# Altium schematic sheet Display.SchDoc
size A4; SheetNumber: 5; SheetTotal: 5
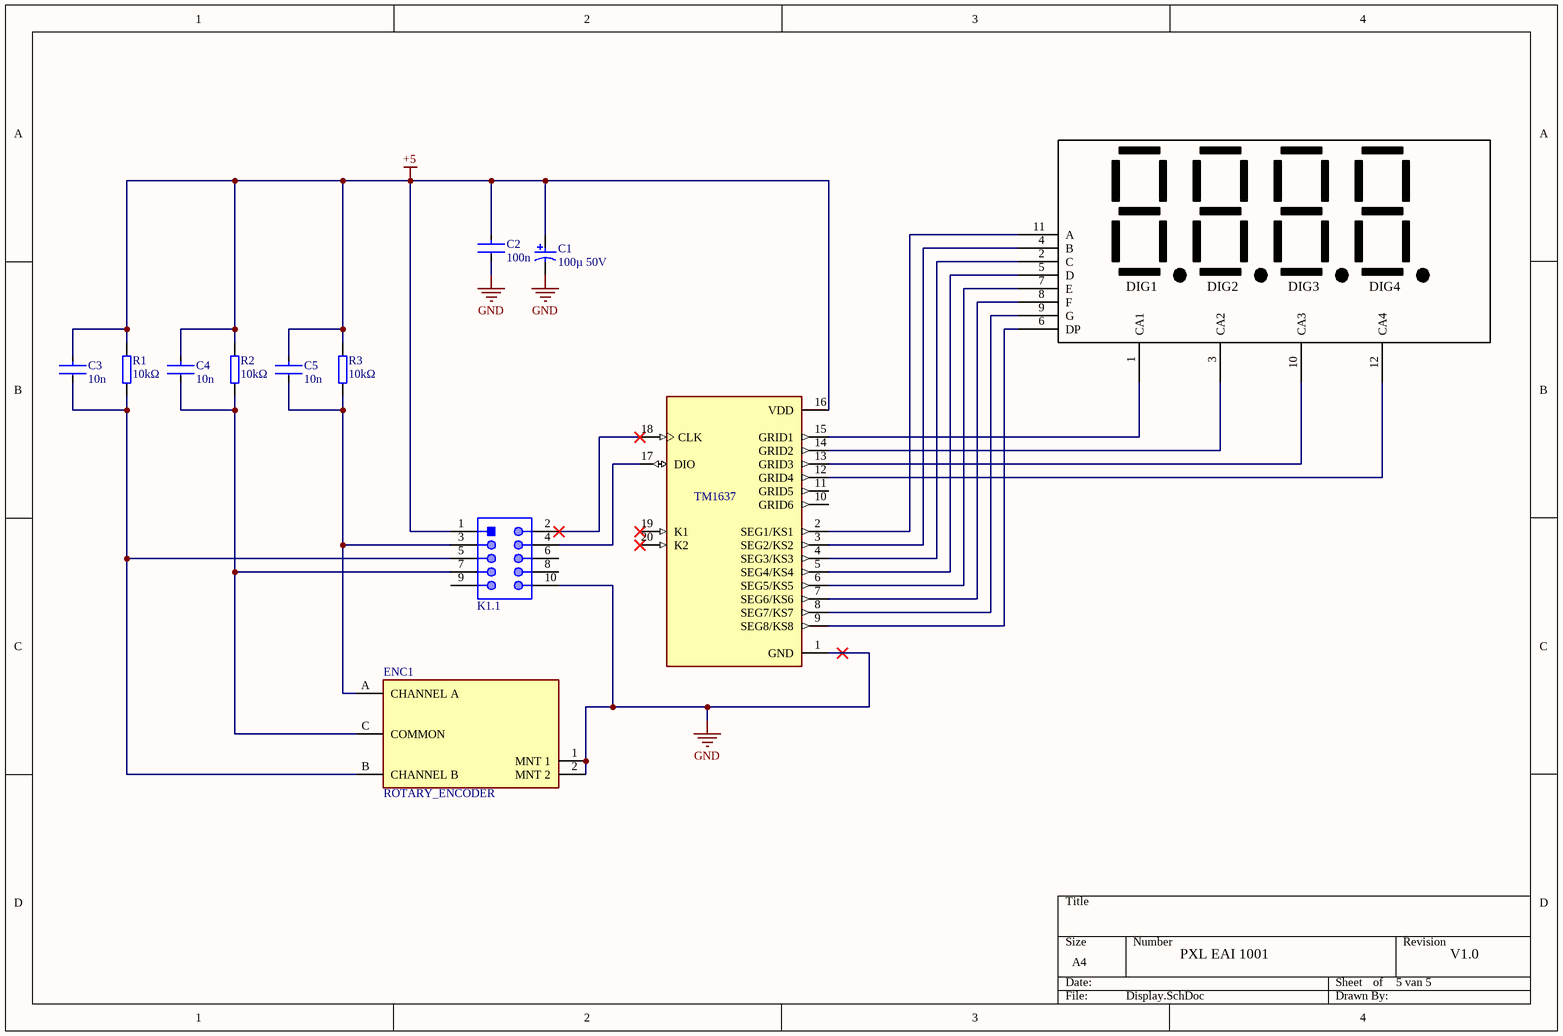
[diagram p0: Display.SchDoc]

## Parts
C1  100µ 50V  [CC_0805_L]
C2  100n  [CC_0805_L]
C3  10n  [CC_0805_L]
C4  10n  [CC_0805_L]
C5  10n  [CC_0805_L]
Display  Sigment  [7-Sigment]  (value not drawn)
ENC1  ROTARY_ENCODER  [PEC11R_4220F_S0012]
K1.1  61201021621  [box header 10-pin]  (value not drawn)
R1  10kΩ  [R_0805_M]
R2  10kΩ  [R_0805_M]
R3  10kΩ  [R_0805_M]
TM1637  TM1637  [SOP_20_M]

## Nets
+5: C1.2 C2.1 C3.1 C4.1 C5.1 K1.1.1 R1.2 R2.2 R3.2 TM1637.16(VDD)
GND: C1.1 C2.2 ENC1.1(MNT_1) ENC1.2(MNT_2) K1.1.10 TM1637.1(GND)
NetC3_2: C3.2 ENC1.B(CHANNEL_B) K1.1.5 R1.1
NetC4_2: C4.2 ENC1.C(COMMON) K1.1.7 R2.1
NetC5_2: C5.2 ENC1.A(CHANNEL_A) K1.1.3 R3.1
NetDisplay_1: Display.1(CA1) TM1637.15(GRID1)
NetDisplay_2: Display.2(C) TM1637.4(SEG3/KS3)
NetDisplay_3: Display.3(CA2) TM1637.14(GRID2)
NetDisplay_4: Display.4(B) TM1637.3(SEG2/KS2)
NetDisplay_5: Display.5(D) TM1637.5(SEG4/KS4)
NetDisplay_6: Display.6(DP) TM1637.9(SEG8/KS8)
NetDisplay_7: Display.7(E) TM1637.6(SEG5/KS5)
NetDisplay_8: Display.8(F) TM1637.7(SEG6/KS6)
NetDisplay_9: Display.9(G) TM1637.8(SEG7/KS7)
NetDisplay_10: Display.10(CA3) TM1637.13(GRID3)
NetDisplay_11: Display.11(A) TM1637.2(SEG1/KS1)
NetDisplay_12: Display.12(CA4) TM1637.12(GRID4)
NetK1.1_2: K1.1.2 TM1637.18(CLK)
NetK1.1_4: K1.1.4 TM1637.17(DIO)

Not connected (* = marked no-connect by the designer): K1.1 6 8 9; TM1637 10(GRID6) 11(GRID5) 19(K1)* 20(K2)*

## Notes on the sheet
- PXL EAI 1001
- V1.0
- (in symbol Display 4digit 7segment) DIG1; DIG2; DIG3; DIG4

## Library data of the parts
C1 = Capacitor_Electrolytic: Manufacturer: Panasonic; Voltage Rating: 25 V; ComponentLink2URL: http://industrial.panasonic.com/cdbs/www-data/pdf/RDE0000/ABA0000C1181.pdf; Height: 10.2 mm; Max Operating Temperature: 105 degC; PackageReference: EEE-FK1E221P; ComponentLink1Description: Manufacturer URL; ComponentLink1URL: http://www.panasonic.com/; Mount: Surface Mount; REACH SVHC: No SVHC; Min Operating Temperature: -55 degC; ComponentLink2Description: Datasheet; DatasheetVersion: 03/2016; Length: 10.2 mm; RoHSCompliant: true; Packaging: Tape and Reel; Package Quantity: 500; Lead Pitch: 3.1 mm; Pins: 2; PackageDescription: 2-Pin Electrolytic Aluminum Capacitor, Body 8.3 x 8.3 mm; Mounting Technology: Surface Mount
C2-C5 = Capacitor_Ceramic: Manufacturer: KEMET; Manufacturer Part Number: C0805C224K5RACTU; Value: 0.22 μF; Temperature Characteristic: X7R; Temperature Coefficient: 30ppm/°C; Tolerance: 0.1; Voltage Rating: 50 V; ComponentLink2URL: https://content.kemet.com/datasheets/KEM_C1003_C0G_SMD.pdf; Device Class L3: Ceramic Capacitors; Lead Free: Yes; Temperature: -55°C to +125°C; RoHS: TRUE; Capacitance: 0.22 μF; Automotive: No; Material: Ceramic; Octopart: https://octopart.com/c0805c224k5ractu-kemet-144670; Temperature Range Low: -55°C; Height: 0.88mm; Device Class L1: Passive Components; Digikey Description: CAP CER 0.22UF 50V X7R 0805; ComponentLink2Description: Datasheet; Mouser Description: CAP CER 0.22UF 50V X7R 0805; Category: Cap; Ipc Land Pattern Name: CAPC200125X78; Temperature Range High: +125°C; Package: C0805C-DN; Device Class L2: Capacitors
Display = Display 4digit 7segment
ENC1 = ROTARY_ENCODER: Manufacturer Part Number: PEC11R-4015F-N0024; Manufacturer: Bourns; Current Rating: 10mA; Number Of Circuits: 1; Conn Orientation: Vertical; Encoder Type: Incremental; Detent: No; Pulses Per Rev: 24; Voltage Rating Dc: 5V; Height: 22.3mm; ComponentLink2URL: https://www.bourns.com/docs/product-datasheets/pec11r.pdf?sfvrsn=bb617cbf_7; Mouser Description: Encoders 15mm SHAFT NO SWITCH; Package: 0; RoHS: TRUE; Temperature Range High: +70°C; Device Class L1: Electromechanical; Device Class L3: Encoders; Temperature Range Low: -30°C; Device Class L2: Switches; Temperature: -30°C to +70°C; Category: Enc; ComponentLink2Description: Datasheet; Lead Free: Yes; Automotive: No; Octopart: https://octopart.com/pec11r-4015f-n0024-bourns-26648251; Digikey Description: ROTARY ENCODER MECHANICAL 24PPR
K1.1 = 5x2: Male Box Header WR-BHD, THT, Vertical, pitch 2.54 mm, 10 pins; Manufacturer: Wurth Elektronik; Contact Resistance: 20mOhm; Withstanding Voltage: 500VAC; Pin Number: 10; Working Voltage: 250VAC; Pitch: 2.54mm; Mounting Technology: THT; Operating Temperature: -40to125degC; Published Date: August2018; Gender: Male; Packaging: Tray; Manufacturer URL: http://www.we-online.de; Datasheet URL: https://katalog.we-online.de/em/datasheet/6120xx21621.pdf; Orientation: Vertical; Package Reference: 61201021621; Part Number: 61201021621; Publisher: WurthElektronik
R1-R3 = Resistor: Manufacturer: Vishay Dale; Part Number: CRCW08050000Z0EA
TM1637 = TM1637: LED Drive Control Special Circuit; MF: Titan Micro Electronics; Package: Package; Availability: Not in stock; SnapEDA_Link: https://www.snapeda.com/parts/TM1637/Titan+Micro+Electronics/view-part/?ref=snap; MP: TM1637; Check_prices: https://www.snapeda.com/parts/TM1637/Titan+Micro+Electronics/view-part/?ref=eda; Value: *; Price: None